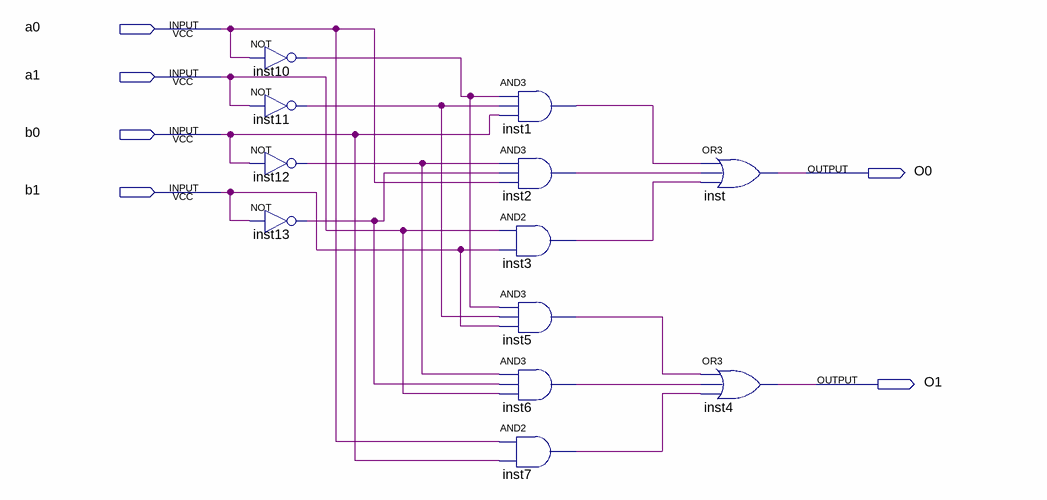
[diagram p0: schematic sheet]
// Quartus schematic modulo3_adder.bdf as structural Verilog: 12 symbols, 6 pins
module modulo3_adder (
  input  a0,
  input  a1,
  input  b0,
  input  b1,
  output O0,
  output O1
);

  wire inst1_out, inst2_out, inst3_out, inst5_out, inst6_out, inst7_out, inst10_out, inst11_out, inst12_out,
       inst13_out;

  not inst10 (inst10_out, a0);
  not inst11 (inst11_out, a1);
  not inst12 (inst12_out, b0);
  not inst13 (inst13_out, b1);
  and inst1 (inst1_out, inst10_out, inst11_out, b0);
  and inst2 (inst2_out, inst12_out, inst13_out, a0);
  and inst3 (inst3_out, a1, b1);
  and inst5 (inst5_out, inst10_out, inst11_out, b1);
  and inst6 (inst6_out, inst12_out, inst13_out, a1);
  and inst7 (inst7_out, a0, b0);
  or inst (O0, inst1_out, inst2_out, inst3_out);
  or inst4 (O1, inst5_out, inst6_out, inst7_out);
endmodule
